# EAGLE design sense (EAGLE 7.0.0)
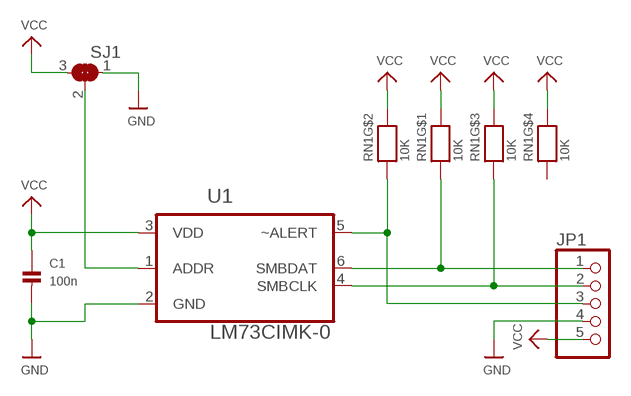
[diagram p0: schematic, sheet 1]

## Parts
C1  100n  CAP_CERAMIC0805  [0805]
JP1  PINHD-1X5  [1X05]
RN1  10K  RESISTOR_4PACK  [RESPACK_4X0603]
SJ1  SOLDERJUMPER_2WAY0603  [SOLDERJUMPER_2WAY_OPEN_0603]
U1  LM73CIMK-0  [SOT95P285X100-6N]

## Nets
ALERT: JP1.3 RN1.2 U1.5(~ALERT)
GND: C1.2 JP1.4 SJ1.1 U1.2(GND)
N$1: SJ1.2 U1.1(ADDR)
SCL: JP1.2 RN1.3 U1.4(SMBCLK)
SDA: JP1.1 RN1.1 U1.6(SMBDAT)
VCC: C1.1 JP1.5 RN1.5 RN1.6 RN1.7 RN1.8 SJ1.3 U1.3(VDD)
Unconnected: RN1.4

## Library data of the parts
C1 = microbuilder:CAP_CERAMIC: Ceramic Capacitors 0402 - 0402 Surface Mount Capacitors 16pF 50V 5% [Digikey: 445-4899-2-ND] 18pF 50V 5% [Digikey: 490-1281-2-ND] 22pF 50V 5% [Digikey: 490-1283-2-ND] 68pF 50V 5% [Digikey: 490-1289-2-ND] 0.1uF 10V 10% [Digikey: 490-1318-2-ND] 1.0uF 6.3V 10% [Digikey: 490-1320-2-ND] 0603 - 0603 Surface Mount Capacitors 16 pF 50V 5% [Digikey: 445-5051-2-ND] 22 pF 50V [Digikey: PCC220ACVTR-ND] 33 pF 50V 5% [Digikey: 490-1415-1-ND] 56pF 50V 5% [Digikey: 490-1421-1-ND] 220pF 50V 5% [Digikey: 445-1285-1-ND] 680 pF 50V 2200 pF 50V 5% C0G [Digikey: 445-1297-1-ND] 5600 pF 100V 5% X7R [Digikey: 478-3711-1-ND] 0.1 µF 25V 10% [Digikey: PCC2277TR-ND] 0.22 µF 16V 10% X7R [Digikey: 445-1318-1-ND] 1.0 µF 25V 10% [Digikey: 445-5146-2-ND] 0603 - RF Specific 3pF 250V +/-0.1pF RF [Digikey: 712-1347-1-ND] 18 pF 250V 5% [Digikey: 478-3505-1-ND or 712-1322-1-ND] 56 pF 250V 5% C0G RF [Digikey: 490-4867-1-ND] 68 pF 250V RF [Digikey: 490-4868-1-ND] 0805 - 0805 Surface Mount Capacitors 220 pF 250V 2% RF Ceramic Capacitor [Digikey: 712-1398-1-ND] 1000 pF 50V 2% NP0 Ceramic Capacitor [Digikey: 478-3760-1-ND] 0.1 µF 25V 10% Ceramic Capacitor [Digikey: PCC1828TR-ND] 1.0 µF 16V 10% Ceramic Capacitor[Digikey: 490-1691-2-ND] 10.0 µF 10V 10% Ceramic Capacitor[Digikey: 709-1228-1-ND] 10.0 uF 16V 10% Ceramic Capacitor [Digikey: 478-5165-2-ND] 47 uF 6.3V 20% Ceramic Capacitor [Digikey: 587-1779-1-ND or 399-5506-1-ND] 1206 - 1206 Surface Mount Capacitors 47uF 10V 20% Ceramic Capacitor [Digikey: 490-5528-1-ND or 399-5508-1-ND or 445-6010-1-ND] 100uF 6.3V -20%, +80% Y5V Ceramic Capacitor (Digikey: 490-4512-1-ND, Mouser: 81-GRM31CF50J107ZE1L)
JP1 = pinhead:PINHD-1X5: PIN HEADER
RN1 = microbuilder:RESISTOR_4PACK: Resistor Packs (4 resistors) 4 x 0603 10K 1/16W - Digikey: YC164J-10KCT-ND
SJ1 = microbuilder:SOLDERJUMPER_2WAY: 2-Way Solder Jumper
U1 = zak:LM73CIMK-0: Digital Temperature Sensor; MPN: LM73CIMK-0; OC_FARNELL: 1312598; OC_NEWARK: 69K2606; PACKAGE: SOT-23-6; SUPPLIER: National Semiconductor

## Board
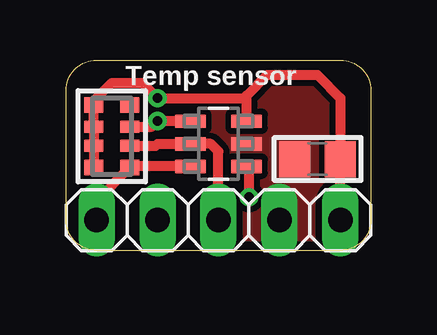
[diagram p1: board, top side]
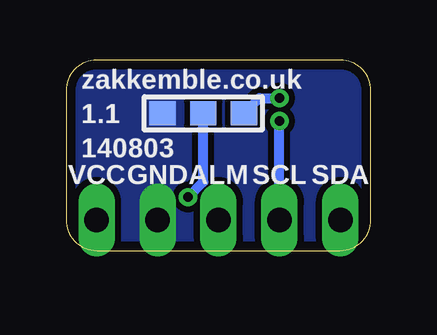
[diagram p2: board, bottom side, seen from below]

Size 12.7 x 7.94 mm. Coordinates in mm from the lower left corner, seen from the top.
Outline: 1.27,0 arc-90 0,1.27 0,6.67 arc-90 1.27,7.94 11.43,7.94 arc-90 12.7,6.67 12.7,1.27 arc-90 11.43,0 1.27,0
Copper layers (1*16): Top 0.0356mm / dielectric 1.5011mm / Bottom 0.0356mm
Design rules "LaenPCBOrder *": minimum track width 6mil, minimum drill 13mil, track to track 6mil, track to pad 6mil, pad to pad 6mil, via to via 6mil, smd to smd 6mil, copper to edge 15mil, drill to drill 6mil, minimum pad ring 7mil, minimum via ring 7mil, stop-mask expansion 4mil, vias tented up to drill 26mil, thermal gap 10mil

### Footprints (pad centres in the part's own frame; a part is rotated, then mirrored left to right if it is on the bottom)
0805 = smd 1.3 x 1.5: 1 -0.95,0; 2 0.95,0
1X05 = drill 1.016 long: 1 -5.08,0; 2 -2.54,0; 3 0,0; 4 2.54,0; 5 5.08,0
RESPACK_4X0603 = smd 0.65 x 0.8: 1 -1.3,-0.75; 4 1.3,-0.75; 5 1.3,0.75; 8 -1.3,0.75 | smd 0.5 x 0.8: 2 -0.4,-0.75; 3 0.4,-0.75; 6 0.4,0.75; 7 -0.4,0.75
SOLDERJUMPER_2WAY_OPEN_0603 = smd 1.1 x 1: 1 -1.7,0; 2 0,0; 3 1.7,0
SOT95P285X100-6N = smd 1.27 x 0.559: 1 -1.168,0.94; 2 -1.168,0; 3 -1.168,-0.94; 4 1.168,-0.94; 5 1.168,0; 6 1.168,0.94

### Placement (x,y rotation side)
C1  10.48,3.81 180 top
JP1  6.35,1.27 0 top
RN1  1.91,4.76 90 top
SJ1  6.99,5.71 0 bottom
U1  6.35,4.45 180 top

### Tracks (layer width: path | path; a pad name or v marks a point on that pad's centre or on a via)
ALERT
  Top 0.406: RN1.2 3.73,4.36 3.81,4.45 U1.5 6.03,4.45 6.35,4.13 JP1.3
GND
  pour Bottom (isolate 0.254, rank 6, no thermals): 0,7.94 12.7,7.94 12.7,0 0,0
  pour Top (isolate 0.254, rank 6, no thermals): 0,7.94 12.7,7.94 12.7,0 0,0
N$1  (via drill 0.4)
  Top 0.406: U1.1 7.62,3.5 v7.62,2.22
  Bottom 0.406: v7.62,2.22 6.99,2.86 SJ1.2
SCL  (via drill 0.4)
  Top 0.406: RN1.3 3.58,5.16 v3.81,5.4 | 3.82,5.38 v3.81,5.4 | U1.4 3.81,5.38 v3.81,5.4
  Bottom 0.406: JP1.2 v3.81,5.4
SDA
  Top 0.406: 2.7,3.5 RN1.1 | RN1.1 1.27,2.08 JP1.1 | U1.6 2.66,3.5 RN1.1
VCC  (via drill 0.4)
  Top 0.406: RN1.8 RN1.7 RN1.6 RN1.5 1.16,6.23 1.91,6.98 3.17,6.98 v3.81,6.35 7.42,6.35 7.52,6.45 | JP1.5 11.43,3.49 C1.1 | 11.11,3.81 C1.1 | C1.1 11.43,4.13 11.43,6.35 10.48,7.3 8.37,7.3 7.52,6.45 | U1.3 7.52,6.45
  Bottom 0.406: SJ1.3 4.65,6.35 v3.81,6.35

### Text on the board
tPlace: Temp sensor
bPlace: zakkemble.co.uk | 1.1 | 140803 | SDA | SCL | ALM | GND | VCC